# Altium project RocketPayloadV1.PrjPcb (part 2 of 2)

## Sheet Sheet2.SchDoc
size A4
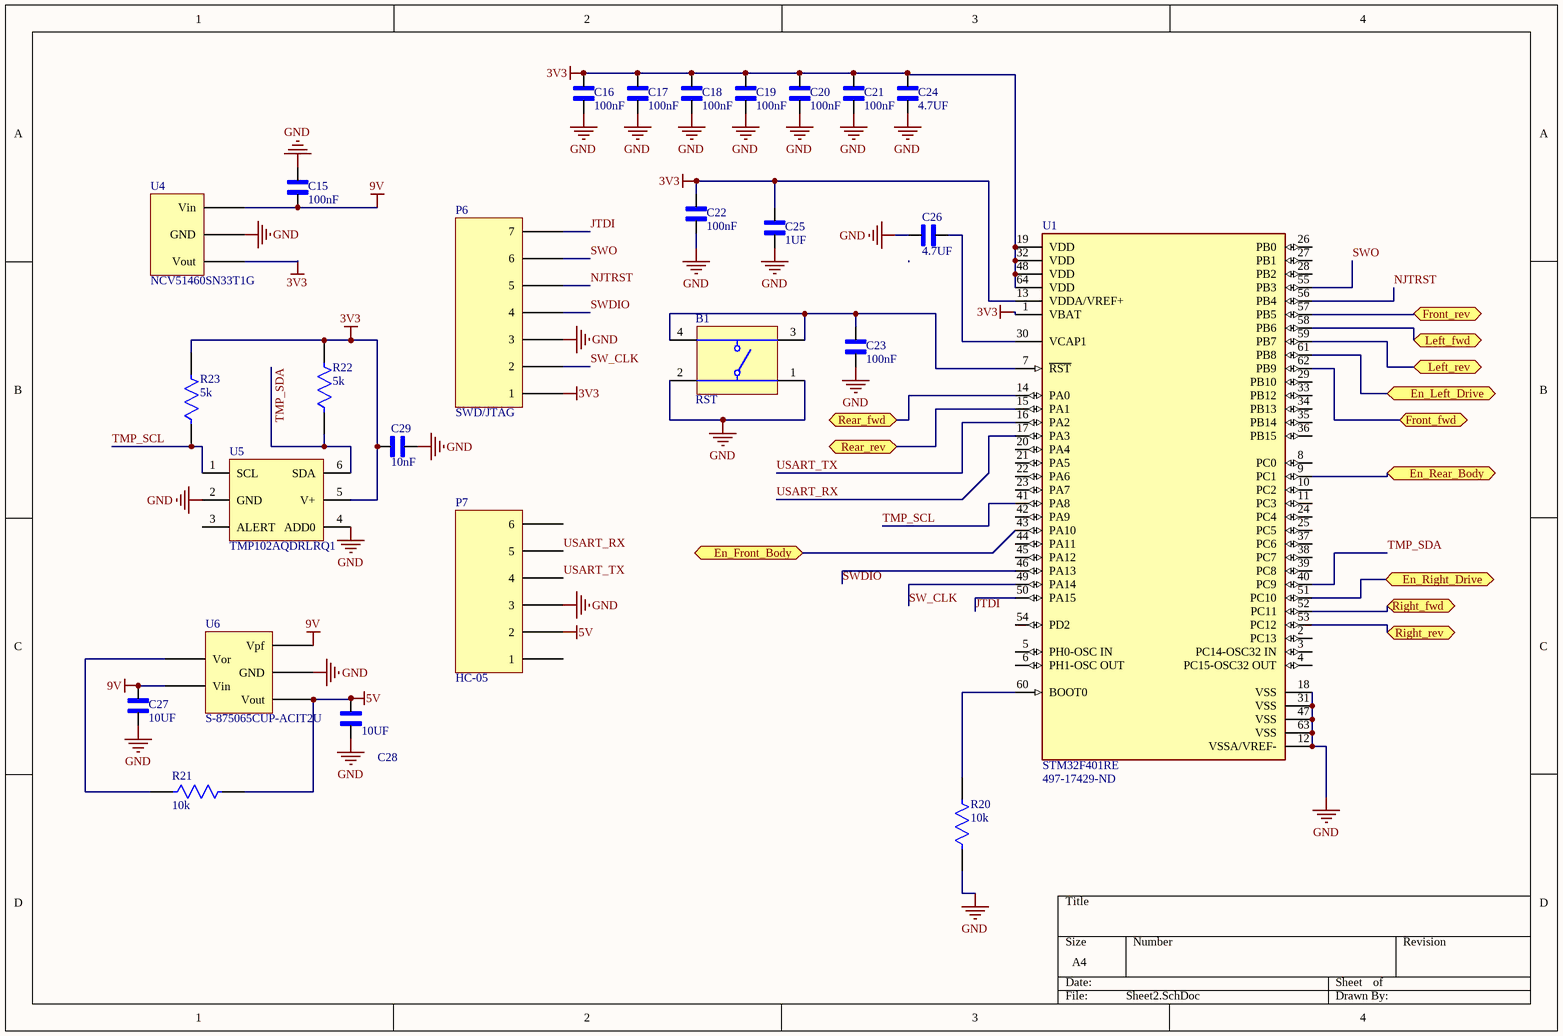
[diagram p1: Sheet2.SchDoc]

### Parts
B1  RST  [ResetButton]
C15  100nF  [0402 Capacitor]
C16  100nF  [0402 Capacitor]
C17  100nF  [0402 Capacitor]
C18  100nF  [0402 Capacitor]
C19  100nF  [0402 Capacitor]
C20  100nF  [0402 Capacitor]
C21  100nF  [0402 Capacitor]
C22  100nF  [0402 Capacitor]
C23  100nF  [0402 Capacitor]
C24  4.7UF  [0402 Capacitor]
C25  1UF  [0402 Capacitor]
C26  4.7UF  [0402 Capacitor]
C27  10UF  [0805 Capacitor]
C28  10UF  [0805 Capacitor]
C29  10nF  [0402 Capacitor]
P6  SWD/JTAG  [FemaleSocketHeaders]
P7  HC-05  [6FemaleSocketHeaders]
R20  10k  [0402 Resistor]
R21  10k  [0402 Resistor]
R22  5k  [0805 Resistor]
R23  5k  [0805 Resistor]
U1  STM32F401RE  Supplier Part Number 1: 497-17429-ND  [STM32F401RE]
U4  NCV51460SN33T1G  [LDO]
U5  TMP102AQDRLRQ1  [SOP6]
U6  S-875065CUP-ACIT2U  [SOT-89-5]

### Ports
En_Front_Body (bidir), En_Left_Drive (bidir), En_Rear_Body (bidir), En_Right_Drive (bidir), Front_fwd (bidir), Front_rev (bidir), Left_fwd (bidir), Left_rev (bidir), Rear_fwd (bidir), Rear_rev (bidir), Right_fwd (bidir), Right_rev (bidir)

### Nets
3V3: C16.2 C17.2 C18.2 C19.2 C20.2 C21.2 C22.2 C24.2 C25.2 C29.2 P6.1 R22.2 R23.2 U1.1(VBAT) U1.13(VDDA/VREF+) U1.19(VDD) U1.32(VDD) U1.48(VDD) U1.64(VDD) U4.?3(Vout) U5.5(V+)
5V: C28.2 P7.2 R21.2 U6.?3(Vout)
9V: C15.1 C27.2 U4.?1(Vin) U6.?1(Vpf) U6.?4(Vin)  [project net VS_A_Body]
GND: B1.1 B1.2 C15.2 C16.1 C17.1 C18.1 C19.1 C20.1 C21.1 C22.1 C23.1 C24.1 C25.1 C26.1 C27.1 C28.1 C29.1 P6.3 P7.3 R20.1 U1.12(VSSA/VREF-) U1.18(VSS) U1.31(VSS) U1.47(VSS) U1.63(VSS) U4.?2(GND) U5.2(GND) U5.4(ADD0) U6.?2(GND)
JTDI: P6.7 U1.50(PA15)
NJTRST: P6.5 U1.56(PB4)
SW_CLK: P6.2 U1.49(PA14)
SWDIO: P6.4 U1.46(PA13)
SWO: P6.6 U1.55(PB3)
TMP_SCL: R23.1 U1.41(PA8) U5.1(SCL)
TMP_SDA: R22.1 U1.40(PC9) U5.6(SDA)
USART_RX: P7.5 U1.17(PA3)
USART_TX: P7.4 U1.16(PA2)
NetB1_3: B1.3 B1.4 C23.2 U1.7(~{RST})
NetC26_2: C26.2 U1.30(VCAP1)
NetR16_2: U1.43(PA10) ; port En_Front_Body
NetR17_2: U1.9(PC1) ; port En_Rear_Body
NetR18_2: U1.61(PB8) ; port En_Left_Drive
NetR19_2: U1.51(PC10) ; port En_Right_Drive
NetR20_2: R20.2 U1.60(BOOT0)
NetR21_1: R21.1 U6.?5(Vor)
NetU1_14: U1.14(PA0) ; port Rear_fwd
NetU1_15: U1.15(PA1) ; port Rear_rev
NetU1_52: U1.52(PC11) ; port Right_fwd
NetU1_53: U1.53(PC12) ; port Right_rev
NetU1_57: U1.57(PB5) ; port Front_rev
NetU1_58: U1.58(PB6) ; port Left_fwd
NetU1_59: U1.59(PB7) ; port Left_rev
NetU1_62: U1.62(PB9) ; port Front_fwd

Not connected (* = marked no-connect by the designer): P7 1 6; U1 2(PC13) 3(PC14-OSC32_IN) 4(PC15-OSC32_OUT) 5(PH0-OSC_IN) 6(PH1-OSC_OUT) 8(PC0) 10(PC2) 11(PC3) 20(PA4) 21(PA5) 22(PA6) 23(PA7) 24(PC4) 25(PC5) 26(PB0) 27(PB1) 28(PB2) 29(PB10) 33(PB12) 34(PB13) 35(PB14) 36(PB15) 37(PC6) 38(PC7) 39(PC8) 42(PA9) 44(PA11) 45(PA12) 54(PD2); U5 3(ALERT)

### Library data of the parts
B1 = Reset Button: SWITCH TACTILE SPST-NO 0.05A 24V; Manufacturer: TE Connectivity Alcoswitch; Manufacturer Part Number: 1825910-6; Mechanical Life: 100000Cycles; Actuator Material: PBT; Max Current Rating: 50mA; Throw Configuration: SPST; Operating Force: 160gf; Contact Resistance: 100mR; Illumination Type: Non-Illuminated,Illuminated; Switch Travel: 0.25mm; Switch Function: Off-Mom; Actuator Type: Standard; Actuator Length: 0.055inch; Supplier 1: Digi-Key; RoHS: Yes; Category: Pushbutton Switches; Stock 1: 8444; Pricing 1: 1=0.10000, 10=0.10100, 25=0.09560, 100=0.08700, 250=0.08180, 500=0.07484, 1000=0.06265, 2500=0.06092, 5000=0.05743 (USD); Mount: Through Hole; Contact Material: Copper Alloy; Contact Plating: Silver; Min Operating Temperature: -35°C; Max Operating Temperature: 85°C; Package Quantity: 750; Packaging: Loose Piece; Max Voltage Rating (DC): 24V; Termination: PC Pins; Electrical Life: 100000Cycles; Orientation: Straight; Contact Current Rating: 50mA; Type: Switch; Length: 5.99mm; Lead Free: Lead Free; REACH SVHC: Unknown; ELV: Compliant; ComponentLink1URL: https://datasheet.ciiva.com/30199/1825910-6rqpn1825910-6-30199520.pdf?src-supplier=Onlinecomponents.com; ComponentLink1Description: https://datasheet.ciiva.com/30199/1825910-6rqpn1825910-6-30199520.pdf?src-supplier=Onlinecomponents.com; ComponentLink2URL: https://datasheet.ciiva.com/15184/getdatasheetpartid-395915-15184509.pdf?src-supplier=Verical; ComponentLink2Description: https://datasheet.ciiva.com/15184/getdatasheetpartid-395915-15184509.pdf?src-supplier=Verical; Supplier Part Number 1: 450-1650-ND
C15-C23 = 100nF Capacitor: CAP CER 0.1UF 16V X7R 0402; Manufacturer: Murata; Manufacturer Part Number: GRM155R71C104KA88J; Tolerance: 10%; Supplier 1: Digi-Key; RoHS: Yes; Category: Ceramic Capacitors; Stock 1: 24888178; Pricing 1: 1=0.10000, 10=0.03800, 100=0.01680, 500=0.01198, 1000=0.00941, 2500=0.00855, 5000=0.00787 (USD); Mount: Surface Mount; Case/Package: 0402; Case Code (Metric): 1005; Case Code (Imperial): 0402; Min Operating Temperature: -55°C; Max Operating Temperature: 125°C; Package Quantity: 1; Capacitance: 100nF; Voltage Rating: 16V; Packaging: Tape and Reel; Dielectric: X7R; Voltage Rating (DC): 16V; Termination: SMD/SMT; Voltage: 16V; Length: 1mm; Height: 0.5mm; Width: 0.02inch; Thickness: 0.022inch; Depth: 0.5mm; Radiation Hardening: No; REACH SVHC: No SVHC; Lead Free: Lead Free; ComponentLink1URL: https://datasheet.ciiva.com/6271/product-6271168.pdf?src-supplier=Digi-Key; ComponentLink1Description: https://datasheet.ciiva.com/6271/product-6271168.pdf?src-supplier=Digi-Key; ComponentLink2URL: https://datasheet.ciiva.com/6271/grm155r71c104ka88-01-6271231.pdf?src-supplier=Digi-Key; ComponentLink2Description: https://datasheet.ciiva.com/6271/grm155r71c104ka88-01-6271231.pdf?src-supplier=Digi-Key; Supplier Part Number 1: 490-6328-1-ND
C24 C26 = 4.7UF Capacitor: CAP CER 4.7UF 6.3V X5R 0402; Manufacturer: Murata; Manufacturer Part Number: GRM155R60J475ME47D; Tolerance: 20%; Supplier 1: Digi-Key; RoHS: Yes; Category: Ceramic Capacitors; Stock 1: 22068943; Pricing 1: 1=0.16000, 10=0.11600, 100=0.05450, 500=0.03822, 1000=0.03164, 2500=0.02944, 5000=0.02694 (USD); Mount: Surface Mount; Case/Package: 0402; Weight: 0.000212oz; Case Code (Metric): 1005; Case Code (Imperial): 0402; Contact Plating: Tin; Min Operating Temperature: -55°C; Max Operating Temperature: 85°C; Package Quantity: 10000; Capacitance: 4.7uF; Voltage Rating: 6.3V; Packaging: Tape and Reel; Dielectric: X5R; Termination: SMD/SMT; Voltage: 6.3V; Voltage Rating (DC): 6.3V; Length: 1mm; Height: 0.5mm; Width: 0.02inch; Thickness: 0.022inch; Depth: 0.5mm; REACH SVHC: No SVHC; Lead Free: Lead Free; ComponentLink1URL: https://datasheet.ciiva.com/6270/product-6270483.pdf?src-supplier=Digi-Key; ComponentLink1Description: https://datasheet.ciiva.com/6270/product-6270483.pdf?src-supplier=Digi-Key; ComponentLink2URL: https://datasheet.ciiva.com/6268/partnumbering-e-01-6268378.pdf?src-supplier=Digi-Key; ComponentLink2Description: https://datasheet.ciiva.com/6268/partnumbering-e-01-6268378.pdf?src-supplier=Digi-Key; ComponentLink3URL: https://datasheet.ciiva.com/46418/1769893-46418044.pdf?src-supplier=Element14; ComponentLink3Description: https://datasheet.ciiva.com/46418/1769893-46418044.pdf?src-supplier=Element14; ComponentLink4URL: https://datasheet.ciiva.com/46418/1769893-46418045.pdf?src-supplier=Element14; ComponentLink4Description: https://datasheet.ciiva.com/46418/1769893-46418045.pdf?src-supplier=Element14; ComponentLink5URL: https://datasheet.ciiva.com/6268/partnumbering-e-01-6268382.pdf?src-supplier=Digi-Key; ComponentLink5Description: https://datasheet.ciiva.com/6268/partnumbering-e-01-6268382.pdf?src-supplier=Digi-Key; Supplier Part Number 1: 490-5915-1-ND
C25 = 1UF Capacitor: Multilayer Ceramic Capacitors MLCC - SMD/SMT 1uF 6.3V X6S +/-10% 0402 Gen Purp; Manufacturer: Taiyo Yuden; Manufacturer Part Number: JMK105C6105KV-F; Tolerance: 10%; Supplier 1: Digi-Key; RoHS: Yes; Category: Ceramic Capacitors; Stock 1: 2218230; Pricing 1: 1=0.10000, 10=0.04200, 100=0.01860, 500=0.01328, 1000=0.01044, 2500=0.00949, 5000=0.00873 (USD); Mount: Surface Mount; Case/Package: 0402; Contact Plating: Tin; Case Code (Metric): 1005; Case Code (Imperial): 0402; Min Operating Temperature: -55°C; Max Operating Temperature: 105°C; Termination: SMD/SMT; Composition: Ceramic; Package Quantity: 10000; Packaging: Tape and Reel; Capacitance: 1uF; Voltage Rating: 6.3V; Voltage Rating (DC): 6.3V; Dielectric: X6S; Length: 1mm; Height: 0.5mm; Thickness: 0.022inch; Width: 0.02inch; Lead Free: Lead Free; Halogen Free: Halogen Free; ComponentLink1URL: https://datasheet.ciiva.com/30179/154jmk105c6105kv-f-30179507.pdf?src-supplier=Onlinecomponents.com; ComponentLink1Description: https://datasheet.ciiva.com/30179/154jmk105c6105kv-f-30179507.pdf?src-supplier=Onlinecomponents.com; ComponentLink2URL: https://datasheet.ciiva.com/24435/5jmk105c6105kv-f-24435453.pdf?src-supplier=Onlinecomponents.com; ComponentLink2Description: https://datasheet.ciiva.com/24435/5jmk105c6105kv-f-24435453.pdf?src-supplier=Onlinecomponents.com; ComponentLink3URL: https://datasheet.ciiva.com/18700/mlcc-all-e-18700341.pdf?src-supplier=Digi-Key; ComponentLink3Description: https://datasheet.ciiva.com/18700/mlcc-all-e-18700341.pdf?src-supplier=Digi-Key; ComponentLink4URL: https://datasheet.ciiva.com/18700/mlcc-all-e-18700342.pdf?src-supplier=Digi-Key; ComponentLink4Description: https://datasheet.ciiva.com/18700/mlcc-all-e-18700342.pdf?src-supplier=Digi-Key; ComponentLink5URL: https://datasheet.ciiva.com/18700/mlcc-all-e-18700343.pdf?src-supplier=Digi-Key; ComponentLink5Description: https://datasheet.ciiva.com/18700/mlcc-all-e-18700343.pdf?src-supplier=Digi-Key; Supplier Part Number 1: 587-3381-1-ND
C27 C28 = 10UF Capacitor: Ceramic capacitor SMD 0805 10 µF 16 V 10 %; Manufacturer: Samsung; Manufacturer Part Number: CL21A106KOQNNNG; Tolerance: 10%; Dielectric: X5R; Voltage: 16V; Supplier 1: Digi-Key; RoHS: Yes; Category: Ceramic Capacitors; Stock 1: 97074; Pricing 1: 1=0.11000, 10=0.07600, 50=0.04340, 100=0.03590, 500=0.02516, 1000=0.02083 (USD); Mount: Surface Mount; Case/Package: 0805; Case Code (Imperial): 0805; Case Code (Metric): 2012; Material: Ceramic; Min Operating Temperature: -55°C; Max Operating Temperature: 85°C; Capacitance: 10uF; Packaging: Tape and Reel; Package Quantity: 3000; Voltage Rating: 16V; Length: 2mm; Height: 1.25mm; Depth: 1.25mm; Width: 0.049inch; Thickness: 0.053inch; ComponentLink1URL: https://datasheet.ciiva.com/25730/cl21a106koqnnng-25730226.pdf?src-supplier=Digi-Key; ComponentLink1Description: https://datasheet.ciiva.com/25730/cl21a106koqnnng-25730226.pdf?src-supplier=Digi-Key; ComponentLink2URL: https://datasheet.ciiva.com/29199/454932-da-01-en-vs-kondensator-0805-29199423.pdf?src-supplier=Conrad; ComponentLink2Description: https://datasheet.ciiva.com/29199/454932-da-01-en-vs-kondensator-0805-29199423.pdf?src-supplier=Conrad; Supplier Part Number 1: 1276-6455-1-ND
C29 = 10nF Capacitor: CAP CER 10000PF 50V X7R 0402; Manufacturer: KEMET; Manufacturer Part Number: C0402C103M5RACTU; Dielectric Material: Ceramic; Tolerance: 20%; Dissipation Factor: 2.5%; Supplier 1: Digi-Key; RoHS: Yes; Category: Ceramic Capacitors; Stock 1: 104917; Pricing 1: 1=0.10000, 10=0.02200, 100=0.00990, 500=0.00708, 1000=0.00557, 2500=0.00506, 5000=0.00466 (USD); Mount: Surface Mount; Case/Package: 0402; Case Code (Metric): 1005; Case Code (Imperial): 0402; Min Operating Temperature: -55°C; Max Operating Temperature: 125°C; Capacitance: 10nF; Voltage Rating: 50V; Packaging: Tape and Reel; Package Quantity: 10000; Voltage Rating (DC): 50V; Dielectric: X7R; Termination: SMD/SMT; Length: 1mm; Height: 0.5mm; Width: 0.02inch; Thickness: 0.022inch; Lead Pitch: 0.3mm; Depth: 0.5mm; Radiation Hardening: No; ComponentLink1URL: https://datasheet.ciiva.com/18192/getdatasheetpartid-439437-18192407.pdf?src-supplier=Verical; ComponentLink1Description: https://datasheet.ciiva.com/18192/getdatasheetpartid-439437-18192407.pdf?src-supplier=Verical; ComponentLink2URL: https://datasheet.ciiva.com/5414/kem-c1002-x7r-smd-5414682.pdf?src-supplier=Mouser; ComponentLink2Description: https://datasheet.ciiva.com/5414/kem-c1002-x7r-smd-5414682.pdf?src-supplier=Mouser; Supplier Part Number 1: 399-7760-1-ND
P6 = FemaleSockets: CONN RCPT .100" 7POS TIN PCB; Manufacturer: Samtec; Manufacturer Part Number: SSA-107-S-T; Gender: Female; Number of Positions: 7; Max Current Rating: 1A; Connector Type: Receptacle; Contact Resistance: 10mR; Max Voltage Rating (AC): 1kV; Pitch: 2.54mm; Supplier 1: Digi-Key; RoHS: Yes; Category: Connectors; Stock 1: 63; Pricing 1: 1=0.73000, 10=0.68500, 25=0.61680, 50=0.54820, 100=0.52530, 250=0.47960, 500=0.45676 (USD); Mount: Through Hole; Housing Color: Black; Housing Material: Polyethylene; Color: Black; Contact Plating: Tin; Contact Material: Bronze; Min Operating Temperature: -55°C; Max Operating Temperature: 105°C; Termination: Solder; Number of Contacts: 7; Package Quantity: 1; Number of Rows: 1; Packaging: Bulk; Orientation: Straight; Length: 17.78mm; Width: 2.54mm; Depth: 2.54mm; Radiation Hardening: No; Lead Free: Lead Free; Flammability Rating: UL94 V-0; ComponentLink1URL: https://datasheet.ciiva.com/413/ssas-mkt-413352.pdf?src-supplier=Digi-Key; ComponentLink1Description: https://datasheet.ciiva.com/413/ssas-mkt-413352.pdf?src-supplier=Digi-Key; ComponentLink2URL: https://datasheet.ciiva.com/10323/ssa-10323769.pdf?src-supplier=Avnet; ComponentLink2Description: https://datasheet.ciiva.com/10323/ssa-10323769.pdf?src-supplier=Avnet; ComponentLink3URL: https://datasheet.ciiva.com/26825/getdatasheetpartid-51286-26825370.pdf?src-supplier=Verical; ComponentLink3Description: https://datasheet.ciiva.com/26825/getdatasheetpartid-51286-26825370.pdf?src-supplier=Verical; ComponentLink4URL: https://datasheet.ciiva.com/16720/ssa-16720191.pdf?src-supplier=Avnet+Europe; ComponentLink4Description: https://datasheet.ciiva.com/16720/ssa-16720191.pdf?src-supplier=Avnet+Europe; Supplier Part Number 1: SAM1122-07-ND
P7 = 6FemaleHeadersRight: CONN HDR 6POS 0.1 TIN PCB R/A; Manufacturer: Sullins; Manufacturer Part Number: PPTC061LGBN-RC; Number of Positions: 6; Connector Type: Header,Socket; Pitch: 0.1inch; Supplier 1: Digi-Key; RoHS: Yes; Category: Connectors; Stock 1: 8367; Pricing 1: 1=0.71000, 10=0.66400, 100=0.50920, 500=0.44280, 1000=0.36531, 5000=0.32103, 10000=0.31980 (USD); Mount: Through Hole; Contact Material: Bronze; Housing Color: Black; Color: Black; Contact Plating: Tin; Housing Material: Plastic; Termination: Solder; Package Quantity: 1000; Number of Rows: 1; Packaging: Bulk; Length: 15.7mm; Height: 2.4mm; Width: 8.5mm; Lead Free: Lead Free; ComponentLink1URL: https://media.digikey.com/pdf/Data%20Sheets/Sullins%20PDFs/Female_Headers.100_DS.pdf?src-supplier=Digi-Key; ComponentLink1Description: https://media.digikey.com/pdf/Data%20Sheets/Sullins%20PDFs/Female_Headers.100_DS.pdf?src-supplier=Digi-Key; Supplier Part Number 1: S5442-ND
R20 R21 = 10k Resistor: Res Thin Film 0402 10K Ohm 0.5% 0.063W(1/16W) ±25ppm/C Molded SMD Automotive Punched T/R; Manufacturer: Panasonic; Manufacturer Part Number: ERA-2AED103X; Power Rating: 63mW; Voltage Rating: 25V; Resistance: 10kR; Temperature Coefficient: 25ppm/°C; Supplier 1: Digi-Key; RoHS: Yes; Category: Chip SMD Resistors; Stock 1: 133108; Pricing 1: 1=0.21000, 10=0.17900, 100=0.07000, 1000=0.02930, 2500=0.02686, 5000=0.02442 (USD); Mount: Surface Mount; Case/Package: 0402; Weight: 2.8E-05oz; Case Code (Imperial): 0402; Case Code (Metric): 1005; Contact Plating: Tin; Min Operating Temperature: -55°C; Max Operating Temperature: 155°C; Tolerance: 0.5%; Packaging: Tape and Reel; Package Quantity: 10000; Termination: SMD/SMT; Composition: Metal Film,Thin Film; Number of Terminations: 2; Military Standard: Not; Max Power Dissipation: 63mW; Voltage Rating (DC): 25V; Length: 1mm; Height: 0.016inch; Width: 0.5mm; Depth: 0.5mm; REACH SVHC: No SVHC; Lead Free: Lead Free; ComponentLink1URL: https://datasheet.ciiva.com/30240/54aoa0000ce26-30240474.pdf?src-supplier=Onlinecomponents.com; ComponentLink1Description: https://datasheet.ciiva.com/30240/54aoa0000ce26-30240474.pdf?src-supplier=Onlinecomponents.com; ComponentLink2URL: https://datasheet.ciiva.com/46378/1776116-46378235.pdf?src-supplier=Element14; ComponentLink2Description: https://datasheet.ciiva.com/46378/1776116-46378235.pdf?src-supplier=Element14; ComponentLink3URL: https://datasheet.ciiva.com/7830/1776116-7830919.pdf?src-supplier=Element14; ComponentLink3Description: https://datasheet.ciiva.com/7830/1776116-7830919.pdf?src-supplier=Element14; ComponentLink4URL: https://datasheet.ciiva.com/43470/1776116-43470437.pdf?src-supplier=Farnell; ComponentLink4Description: https://datasheet.ciiva.com/43470/1776116-43470437.pdf?src-supplier=Farnell; Supplier Part Number 1: P10KDECT-ND
R22 R23 = 5k Resistor: Res Thick Film 0805 5K Ohm 1% 1/8W ±100ppm/°C Molded SMD SMD Paper T/R; Manufacturer: Vishay Dale; Manufacturer Part Number: CRCW08055K00FKTA; Resistance: 5kR; Power Rating: 125mW; Voltage Rating: 150V; Supplier 1: Digi-Key; RoHS: Yes; Category: Chip SMD Resistors; Stock 1: 28646; Pricing 1: 1=0.13000, 10=0.11700, 100=0.04510, 1000=0.01984, 2500=0.01714 (USD); Case/Package: 0805; Number of Pins: 2; Weight: 0.000194oz; Case Code (Imperial): 0805; Case Code (Metric): 2012; Contact Plating: Tin,Lead; Min Operating Temperature: -55°C; Max Operating Temperature: 155°C; Tolerance: 1%; Packaging: Tape and Reel; Package Quantity: 5000; Resistor Type: Thick Film; Termination: SMD/SMT; Number of Terminations: 2; Temperature Coefficient: 100ppm/°C; Max Power Dissipation: 125mW; Voltage Rating (DC): 150V; Features: Automotive AEC-Q200; Length: 0.079inch; Width: 1.25mm; Height: 0.02inch; REACH SVHC: Unknown; Lead Free: Contains Lead; ComponentLink1URL: https://datasheet.ciiva.com/7112/1747955-7112385.pdf?src-supplier=Newark; ComponentLink1Description: https://datasheet.ciiva.com/7112/1747955-7112385.pdf?src-supplier=Newark; ComponentLink2URL: https://datasheet.ciiva.com/9069/dcrcw-9069004.pdf?src-supplier=Avnet; ComponentLink2Description: https://datasheet.ciiva.com/9069/dcrcw-9069004.pdf?src-supplier=Avnet; ComponentLink3URL: https://datasheet.ciiva.com/28561/1747955-28561708.pdf?src-supplier=Element14; ComponentLink3Description: https://datasheet.ciiva.com/28561/1747955-28561708.pdf?src-supplier=Element14; Supplier Part Number 1: 541-4321-1-ND
U1 = STM32F401RE: ARM Microcontrollers - MCU 16/32-BITS MICROS; Manufacturer: STMicroelectronics; Manufacturer Part Number: STM32F401RET6; Min Supply Voltage: 1.7V; Max Supply Voltage: 3.6V; RAM Size: 96KB; Max Power Dissipation: 313mW; Interface: I2C,SPI,USB,IrDA,SDIO,UART,USART,LIN,I2S; Number of I/Os: 50; Number of Timers/Counters: 8; Frequency: 84MHz; Oscillator Type: Internal; Data Bus Width: 32b; Watchdog Timer: Yes; Memory Type: FLASH; Memory Size: 512KB; Peripherals: Brown-out Detect/Reset,POR,PWM,WDT,DMA; Operating Supply Voltage: 3.3V; Supplier 1: Digi-Key; RoHS: Yes; Category: Microcontrollers; Stock 1: 2313; Pricing 1: 1=6.43000, 10=5.80700, 25=5.53680, 100=4.80740, 250=4.59136, 500=4.18624, 1000=3.64608, 2500=3.51104, 5000=3.37600 (USD); Case/Package: LQFP; Number of Pins: 64; Weight: 0.012088oz; Min Operating Temperature: -40°C; Max Operating Temperature: 85°C; Packaging: Tray; Number of Programmable I/O: 50; Max Frequency: 84MHz; Package Quantity: 960; Core Architecture: ARM; Radiation Hardening: No; REACH SVHC: No SVHC; Lead Free: Lead Free; ComponentLink1URL: http://www.farnell.com/datasheets/1899788.pdf?src-supplier=Farnell; ComponentLink1Description: http://www.farnell.com/datasheets/1899788.pdf?src-supplier=Farnell; ComponentLink2URL: http://www.mouser.com/ds/2/389/stm32f401re-956236.pdf?src-supplier=Mouser; ComponentLink2Description: http://www.mouser.com/ds/2/389/stm32f401re-956236.pdf?src-supplier=Mouser; ComponentLink3URL: http://www.farnell.com/datasheets/1899788.pdf?src-supplier=Element14; ComponentLink3Description: http://www.farnell.com/datasheets/1899788.pdf?src-supplier=Element14; ComponentLink4URL: http://www.st.com/st-web-ui/static/active/en/resource/technical/document/datasheet/DM00102166.pdf?src-supplier=Avnet; ComponentLink4Description: http://www.st.com/st-web-ui/static/active/en/resource/technical/document/datasheet/DM00102166.pdf?src-supplier=Avnet; ComponentLink5URL: http://www.st.com/content/ccc/resource/technical/document/errata_sheet/df/f5/fd/26/37/db/42/2b/DM00095523.pdf/files/DM00095523.pdf/jcr:content/translations/en.DM00095523.pdf?src-supplier=Digi-Key; ComponentLink5Description: http://www.st.com/content/ccc/resource/technical/document/errata_sheet/df/f5/fd/26/37/db/42/2b/DM00095523.pdf/files/DM00095523.pdf/jcr:content/translations/en.DM00095523.pdf?src-supplier=Digi-Key; ComponentLink6URL: http://www.farnell.com/datasheets/1899788.pdf?src-supplier=Newark; ComponentLink6Description: http://www.farnell.com/datasheets/1899788.pdf?src-supplier=Newark
U4 = LDO: V-Ref Precision 3.3V 20mA Automotive 3-Pin SOT-23 T/R; Manufacturer: ON Semiconductor; Output Type: Fixed; Output Configuration: Positive; Number of Regulators: 1; Max Input Voltage: 28V; Dropout Voltage: 1.4V; Quiescent Current: 200uA; Max Supply Current: 220uA; Supplier 1: Digi-Key; Manufacturer Part Number: NCV51460SN33T1G; RoHS: No; Category: Voltage References; Stock 1: 3394; Pricing 1: 1=0.95000, 10=0.84800, 25=0.80520, 100=0.61810, 250=0.54624, 500=0.51750, 1000=0.40250 (USD); Mount: Surface Mount; Case/Package: TO-236-3; Min Operating Temperature: -40°C; Max Operating Temperature: 125°C; Packaging: Cut Tape; Min Output Voltage: 3.3V; Output Current: 20mA; ComponentLink1URL: https://media.digikey.com/pdf/Data%20Sheets/ON%20Semiconductor%20PDFs/NCV51460_Web.pdf?src-supplier=Digi-Key; ComponentLink1Description: https://media.digikey.com/pdf/Data%20Sheets/ON%20Semiconductor%20PDFs/NCV51460_Web.pdf?src-supplier=Digi-Key; ComponentLink2URL: http://www.farnell.com/datasheets/2585557.pdf?src-supplier=Farnell; ComponentLink2Description: http://www.farnell.com/datasheets/2585557.pdf?src-supplier=Farnell; Supplier Part Number 1: NCV51460SN33T1GOSCT-ND
U5 = TMP102AQDRLRQ1: SENSOR DIGITAL -40C-125C 6SOT; Manufacturer: Texas Instruments; Output Type: I2C,Digital; Operating Supply Voltage: 3.6V; Quiescent Current: 10uA; Interface: I2C,SMBus,2-Wire; Resolution: 11b; Supplier 1: Digi-Key; Manufacturer Part Number: TMP102AQDRLRQ1; RoHS: Yes; Category: Temperature and Humidity Sensors; Stock 1: 4768; Pricing 1: 1=1.92000, 5=1.81600, 10=1.55700, 25=1.24560, 50=1.14180, 100=1.03800, 500=0.90826, 1000=0.80445 (USD); Mount: Surface Mount; Case/Package: SOT-563; Number of Pins: 6; Min Operating Temperature: -40°C; Max Operating Temperature: 125°C; Packaging: Tape and Reel; Lead Free: Lead Free; ComponentLink1URL: http://www.ti.com/general/docs/lit/getliterature.tsp?genericPartNumber=TMP102-Q1&&fileType=pdf&src-supplier=Avnet; ComponentLink1Description: http://www.ti.com/general/docs/lit/getliterature.tsp?genericPartNumber=TMP102-Q1&&fileType=pdf&src-supplier=Avnet; ComponentLink2URL: http://www.ti.com/lit/gpn/tmp102-q1?src-supplier=Mouser; ComponentLink2Description: http://www.ti.com/lit/gpn/tmp102-q1?src-supplier=Mouser; ComponentLink3URL: http://www.ti.com/general/docs/suppproductinfo.tsp?distId=10&gotoUrl=http%3A%2F%2Fwww.ti.com%2Flit%2Fgpn%2Ftmp102-q1&src-supplier=Digi-Key; ComponentLink3Description: http://www.ti.com/general/docs/suppproductinfo.tsp?distId=10&gotoUrl=http%3A%2F%2Fwww.ti.com%2Flit%2Fgpn%2Ftmp102-q1&src-supplier=Digi-Key; Supplier Part Number 1: 296-40676-1-ND
U6 = LDO_5V: Linear Regulator Positive 5V 4.5mA 5-Pin SOT-89 T/R; Manufacturer: ABLIC; Supplier 1: Digi-Key; Manufacturer Part Number: S-875065CUP-ACIT2U; Stock 1: 100; Pricing 1: 1=1.06000, 10=0.94400, 25=0.89600, 100=0.68800 (USD); Supplier Part Number 1: 1662-2067-1-ND

## Nets that join several sheets
GND: Sheet1 (60 pins), Sheet2 (29 pins)
VS_A_Body: Sheet1 (16 pins), Sheet2 (5 pins)
NetR16_2: Sheet1 (R16.2), Sheet2 (U1.43)
NetR17_2: Sheet1 (R17.2), Sheet2 (U1.9)
NetR18_2: Sheet1 (R18.2), Sheet2 (U1.61)
NetR19_2: Sheet1 (R19.2), Sheet2 (U1.51)
NetU1_14: Sheet1 (U2.26), Sheet2 (U1.14)
NetU1_15: Sheet1 (U2.27), Sheet2 (U1.15)
NetU1_52: Sheet1 (U3.26), Sheet2 (U1.52)
NetU1_53: Sheet1 (U3.27), Sheet2 (U1.53)
NetU1_57: Sheet1 (U2.11), Sheet2 (U1.57)
NetU1_58: Sheet1 (U3.10), Sheet2 (U1.58)
NetU1_59: Sheet1 (U3.11), Sheet2 (U1.59)
NetU1_62: Sheet1 (U2.10), Sheet2 (U1.62)